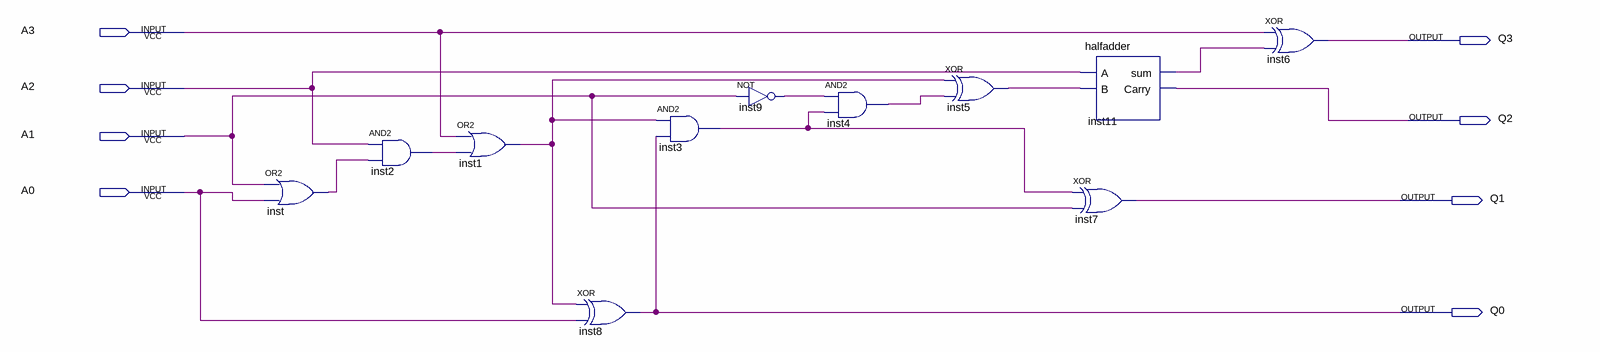
[diagram p0: schematic sheet]
// Quartus schematic Plus3.bdf as structural Verilog: 11 symbols, 8 pins
module Plus3 (
  input  A3,
  input  A2,
  input  A1,
  input  A0,
  output Q3,
  output Q2,
  output Q1,
  output Q0
);

  wire inst1_out, inst2_out, inst3_out, inst4_out, inst5_out, inst9_out, inst11_sum, inst_out;

  or inst (inst_out, A1, A0);
  and inst2 (inst2_out, A2, inst_out);
  or inst1 (inst1_out, A3, inst2_out);
  xor inst8 (Q0, inst1_out, A0);
  and inst3 (inst3_out, inst1_out, Q0);
  not inst9 (inst9_out, A1);
  and inst4 (inst4_out, inst9_out, inst3_out);
  xor inst5 (inst5_out, inst1_out, inst4_out);
  halfadder inst11 (.A(A2), .B(inst5_out), .sum(inst11_sum), .Carry(Q2));
  xor inst7 (Q1, inst3_out, A1);
  xor inst6 (Q3, A3, inst11_sum);
endmodule
